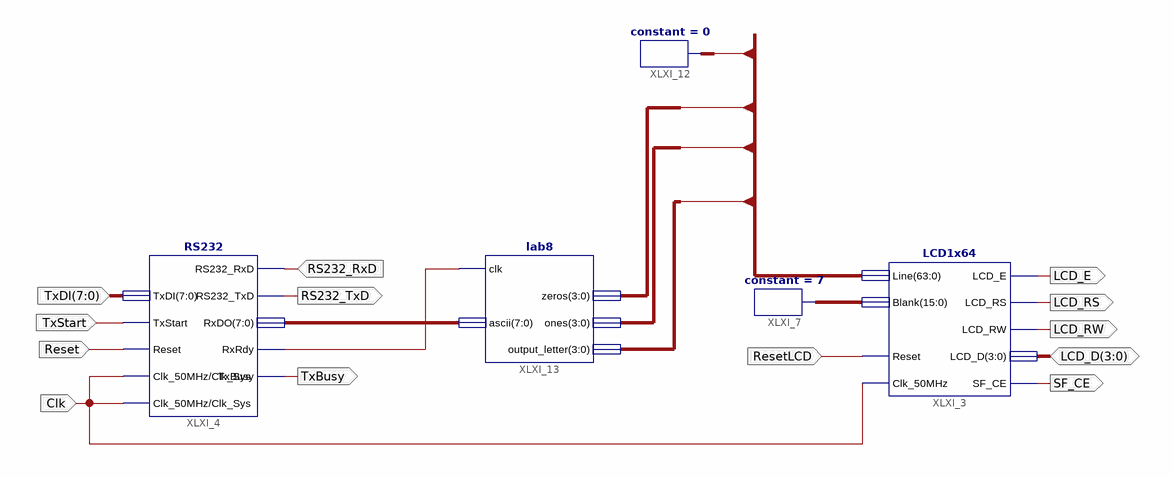
[diagram p0: schematic sheet 1]
// Xilinx ISE schematic lab8schem.sch (spartan3e) as structural Verilog: 5 symbols, 13 ports
module lab8schem (
  input  [7:0] TxDI,
  input  Reset,
  input  TxStart,
  input  Clk,
  input  RS232_RxD,
  input  ResetLCD,
  inout  [3:0] LCD_D,
  output TxBusy,
  output RS232_TxD,
  output LCD_E,
  output LCD_RS,
  output LCD_RW,
  output SF_CE
);

  wire XLXN_70;
  wire [7:0] XLXN_71;
  wire [15:0] Blank;
  wire [63:0] Line_in;

  RS232 XLXI_4 (
    .Clk_50MHz(Clk), .Reset(Reset), .RS232_RxD(RS232_RxD), .TxStart(TxStart), .TxDI(TxDI), .TxBusy(TxBusy),
    .RxRdy(XLXN_70), .RS232_TxD(RS232_TxD), .RxDO(XLXN_71), .Clk_Sys(Clk));
  LCD1x64 XLXI_3 (
    .Clk_50MHz(Clk), .Reset(ResetLCD), .Line(Line_in), .Blank(Blank), .LCD_D(LCD_D), .LCD_E(LCD_E),
    .LCD_RW(LCD_RW), .LCD_RS(LCD_RS), .SF_CE(SF_CE));
  constant #(.CValue("7")) XLXI_7 (.O(Blank));
  constant #(.CValue("0")) XLXI_12 (.O(Line_in[63:12]));
  lab8 XLXI_13 (
    .clk(XLXN_70), .ascii(XLXN_71), .zeros(Line_in[11:8]), .ones(Line_in[7:4]), .output_letter(Line_in[3:0]));
endmodule
